# EAGLE design logic_probe-v1.0c (EAGLE 4.16)
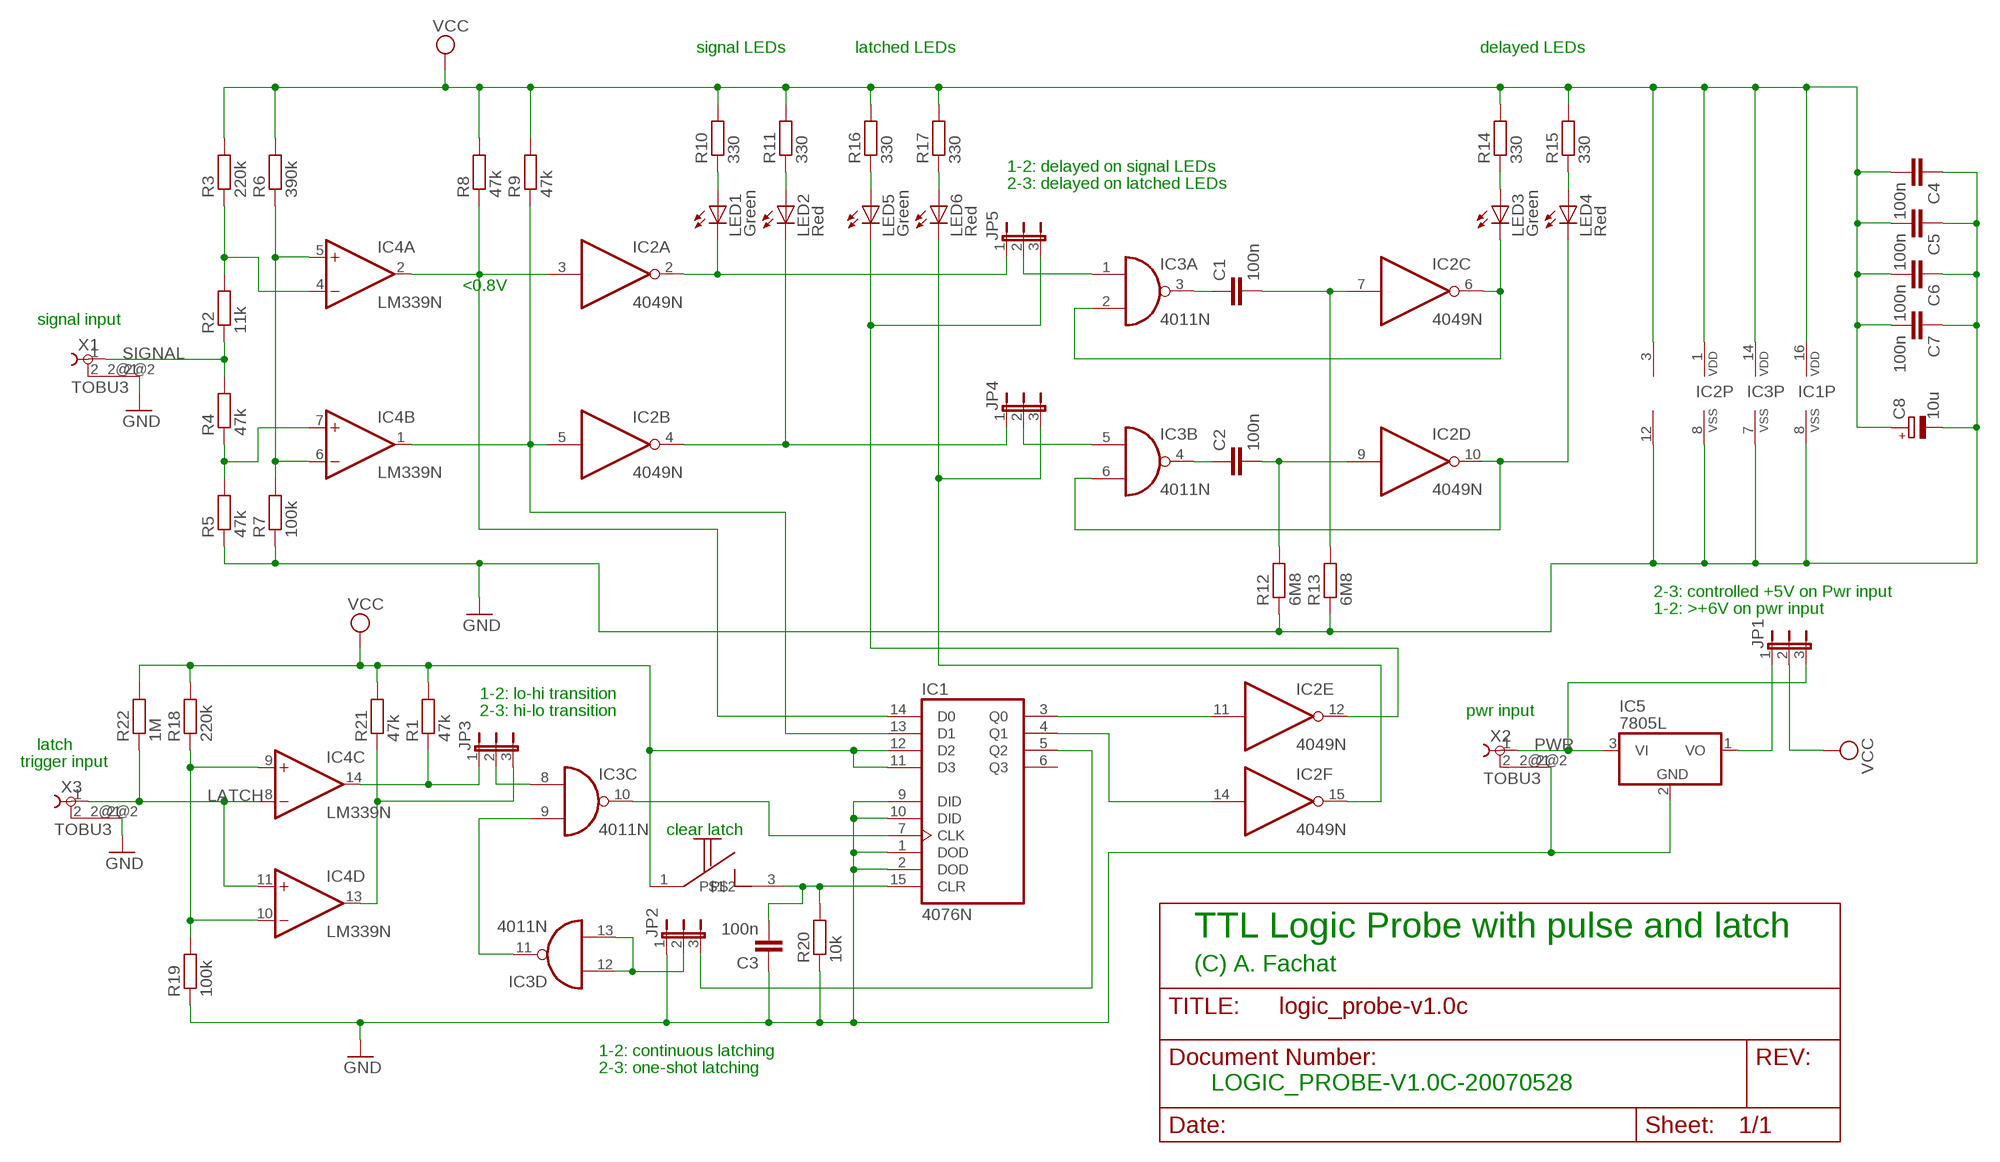
[diagram p0: schematic, sheet 1]

## Parts
C1  100n  C-EU050-025X075  [C050-025X075]
C2  100n  C-EU050-025X075  [C050-025X075]
C3  100n  C-EU050-025X075  [C050-025X075]
C4  100n  C-EU050-025X075  [C050-025X075]
C5  100n  C-EU050-025X075  [C050-025X075]
C6  100n  C-EU050-025X075  [C050-025X075]
C7  100n  C-EU050-025X075  [C050-025X075]
C8  10u  CPOL-EUE2-5  [E2-5]
IC1  4076N  [DIL16]
IC2  4049N  [DIL16]
IC3  4011N  [DIL14]
IC4  LM339N  [DIL14]
IC5  7805L  [TO92]
JP1  JP2E  [JP2]
JP2  JP2E  [JP2]
JP3  JP2E  [JP2]
JP4  JP2E  [JP2]
JP5  JP2E  [JP2]
LED1  Green  LED3MM  [LED3MM]
LED2  Red  LED3MM  [LED3MM]
LED3  Green  LED3MM  [LED3MM]
LED4  Red  LED3MM  [LED3MM]
LED5  Green  LED3MM  [LED3MM]
LED6  Red  LED3MM  [LED3MM]
R1  47k  R-EU_0207/7  [0207/7]
R2  11k  R-EU_0207/7  [0207/7]
R3  220k  R-EU_0207/7  [0207/7]
R4  47k  R-EU_0207/7  [0207/7]
R5  47k  R-EU_0207/7  [0207/7]
R6  390k  R-EU_0207/7  [0207/7]
R7  100k  R-EU_0207/7  [0207/7]
R8  47k  R-EU_0207/7  [0207/7]
R9  47k  R-EU_0207/7  [0207/7]
R10  330  R-EU_0207/7  [0207/7]
R11  330  R-EU_0207/7  [0207/7]
R12  6M8  R-EU_0207/7  [0207/7]
R13  6M8  R-EU_0207/7  [0207/7]
R14  330  R-EU_0207/7  [0207/7]
R15  330  R-EU_0207/7  [0207/7]
R16  330  R-EU_0207/7  [0207/7]
R17  330  R-EU_0207/7  [0207/7]
R18  220k  R-EU_0207/7  [0207/7]
R19  100k  R-EU_0207/7  [0207/7]
R20  10k  R-EU_0207/7  [0207/7]
R21  47k  R-EU_0207/7  [0207/7]
R22  1M  R-EU_0207/7  [0207/7]
U$3  TASTER  [TASTER]
X1  TOBU3  [TOBU3]
X2  TOBU3  [TOBU3]
X3  TOBU3  [TOBU3]

## Nets
GND: C3.1 C4.1 C5.1 C6.1 C7.1 C8.- IC1.1(DOD) IC1.2(DOD) IC1.8(VSS) IC1.9(DID) IC1.10(DID) IC2.8(P:VSS) IC3.7(P:VSS) IC4.12(P:GND) IC5.2(GND) JP2.1 R5.1 R7.1 R12.1 R13.1 R19.1 R20.1 X1.2@2 X2.2@2 X3.2@2
LATCH: IC4.8(C:-IN) IC4.11(D:+IN) R22.1 X3.1
N$1: C1.2 IC2.7(C:I) R13.2
N$2: IC4.4(A:-IN) R2.2 R3.1
N$3: IC1.14(D0) IC2.3(A:I) IC4.2(A:OUT) R8.1
N$4: IC4.7(B:+IN) R4.1 R5.2
N$5: IC4.5(A:+IN) IC4.6(B:-IN) R6.1 R7.2
N$6: C2.2 IC2.9(D:I) R12.2
N$9: IC2.2(A:O) JP5.1 LED1.K(C)
N$10: IC2.4(B:O) JP4.1 LED2.K(C)
N$11: LED1.A R10.1
N$12: LED2.A R11.1
N$13: C1.1 IC3.3(A:O)
N$14: C2.1 IC3.4(B:O)
N$15: IC2.6(C:O) IC3.2(A:I1) LED3.K(C)
N$16: IC2.10(D:O) IC3.6(B:I1) LED4.K(C)
N$17: LED3.A R14.1
N$18: LED4.A R15.1
N$19: IC4.13(D:OUT) JP3.3 R21.1
N$20: LED5.A R16.1
N$21: LED6.A R17.1
N$22: IC1.4(Q1) IC2.14(F:I)
N$23: IC2.15(F:O) JP4.3 LED6.K(C)
N$24: IC2.12(E:O) JP5.3 LED5.K(C)
N$25: IC1.3(Q0) IC2.11(E:I)
N$26: IC4.9(C:+IN) IC4.10(D:-IN) R18.1 R19.2
N$27: IC1.13(D1) IC2.5(B:I) IC4.1(B:OUT) R9.1
N$28: IC4.14(C:OUT) JP3.1 R1.1
N$29: IC1.7(CLK) IC3.10(C:O)
N$30: IC3.1(A:I0) JP5.2
N$31: C3.2 IC1.15(CLR) R20.2 U$3.3
N$32: IC1.5(Q2) JP2.3
N$33: IC3.12(D:I0) IC3.13(D:I1) JP2.2
N$34: IC3.9(C:I1) IC3.11(D:O)
N$36: IC5.1(VO) JP1.1
N$37: IC3.8(C:I0) JP3.2
N$38: IC3.5(B:I0) JP4.2
PWR: IC5.3(VI) JP1.3 X2.1
SIGNAL: R2.1 R4.2 X1.1
VCC: C4.2 C5.2 C6.2 C7.2 C8.+ IC1.11(D3) IC1.12(D2) IC1.16(VDD) IC2.1(P:VDD) IC3.14(P:VDD) IC4.3(P:V+) JP1.2 R1.2 R3.2 R6.2 R8.2 R9.2 R10.2 R11.2 R14.2 R15.2 R16.2 R17.2 R18.2 R21.2 R22.2 U$3.1
Unconnected: IC1.6(Q3) X1.2 X1.2@1 X2.2 X2.2@1 X3.2 X3.2@1

## Notes on the sheet
- signal LEDs | latched LEDs | delayed LEDs
- 1-2: delayed on signal LEDs
- 2-3: delayed on latched LEDs
- <0.8V
- signal input
- 2-3: controlled +5V on Pwr input
- 1-2: >+6V on pwr input
- 1-2: lo-hi transition
- 2-3: hi-lo transition | pwr input
- latch
- trigger input
- clear latch
- TTL Logic Probe with pulse and latch
- (C) A. Fachat
- 1-2: continuous latching
- 2-3: one-shot latching
- LOGIC_PROBE-V1.0C-20070528

## Library data of the parts
C1-C7 = rcl:C-EU: CAPACITOR, European symbol
C8 = rcl:CPOL-EU: POLARIZED CAPACITOR, European symbol
IC1 = 40xx:4076: Quad D-type REGISTER
IC2 = 40xx:4049: Hex inverting BUFFER
IC3 = 40xx:4011: Quad 2-input NAND
IC4 = linear:LM339: Low Power Low Offset Voltage Quad Comparators with open collector; LM139/LM239/LM339/LM2901/LM3302
IC5 = linear:78*: Positive VOLTAGE REGULATOR Source: http://cache.national.com/ds/LM/LM78L05.pdf http://www.fairchildsemi.com/ds/LM/LM7805.pdf
JP1-JP5 = jumper:JP2E: JUMPER
LED1-LED6 = led:LED: LED OSRAM: - CHIPLED LG R971, LG N971, LY N971, LG Q971, LY Q971, LO R971, LY R971 LH N974, LH R974 LS Q976, LO Q976, LY Q976 LO Q996 - Hyper CHIPLED LW Q18S LB Q993, LB Q99A, LB R99A - SideLED LS A670, LO A670, LY A670, LG A670, LP A670 LB A673, LV A673, LT A673, LW A673 LH A674 LY A675 LS A676, LA A676, LO A676, LY A676, LW A676 LS A679, LY A679, LG A679 - Hyper Micro SIDELED® LS Y876, LA Y876, LO Y876, LY Y876 LT Y87S - SmartLED LW L88C, LW L88S LB L89C, LB L89S, LG L890 LS L89K, LO L89K, LY L89K LS L896, LA L896, LO L896, LY L896 - TOPLED LS T670, LO T670, LY T670, LG T670, LP T670 LSG T670, LSP T670, LSY T670, LOP T670, LYG T670 LG T671, LOG T671, LSG T671 LB T673, LV T673, LT T673, LW T673 LH T674 LS T676, LA T676, LO T676, LY T676, LB T676, LH T676, LSB T676, LW T676 LB T67C, LV T67C, LT T67C, LS T67K, LO T67K, LY T67K, LW E67C LS E67B, LA E67B, LO E67B, LY E67B, LB E67C, LV E67C, LT E67C LW T67C LS T679, LY T679, LG T679 LS T770, LO T770, LY T770, LG T770, LP T770 LB T773, LV T773, LT T773, LW T773 LH T774 LS E675, LA E675, LY E675, LS T675 LS T776, LA T776, LO T776, LY T776, LB T776 LHGB T686 LT T68C, LB T68C - Hyper Mini TOPLED® LB M676 - Mini TOPLED Santana® LG M470 LS M47K, LO M47K, LY M47K Source: http://www.osram.convergy.de/
R1-R22 = rcl:R-EU_: RESISTOR, European symbol
U$3 = csa:TASTER
X1-X3 = con-hirschmann:TOBU3: Female Cinch CONNECTOR

## Board
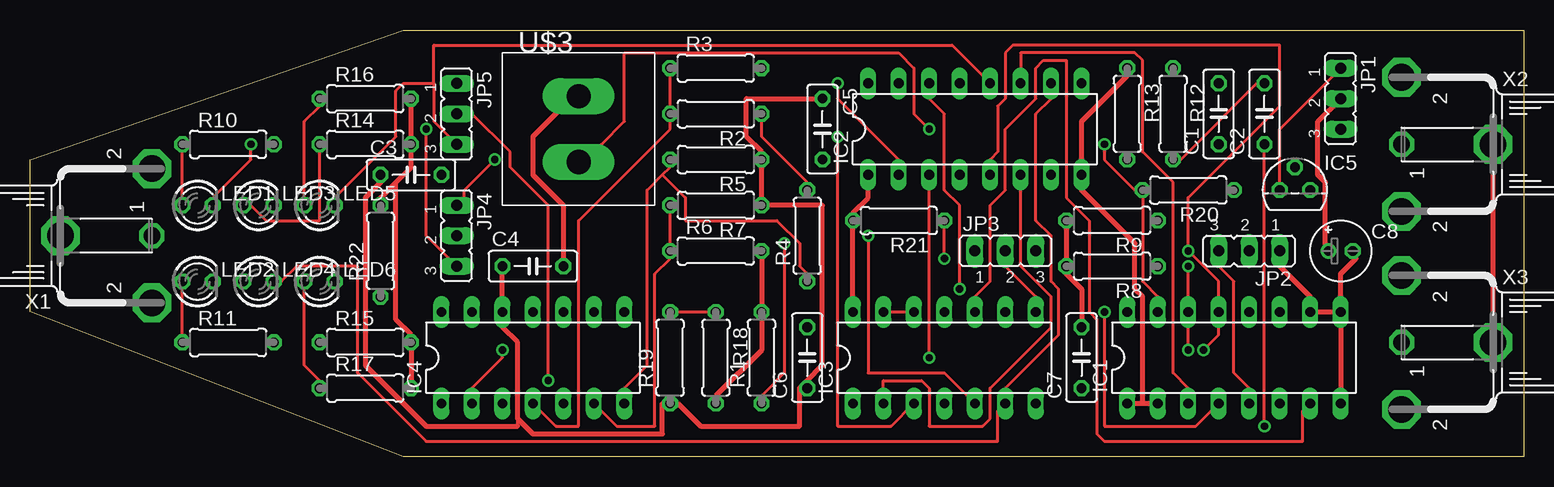
[diagram p1: board, top side]
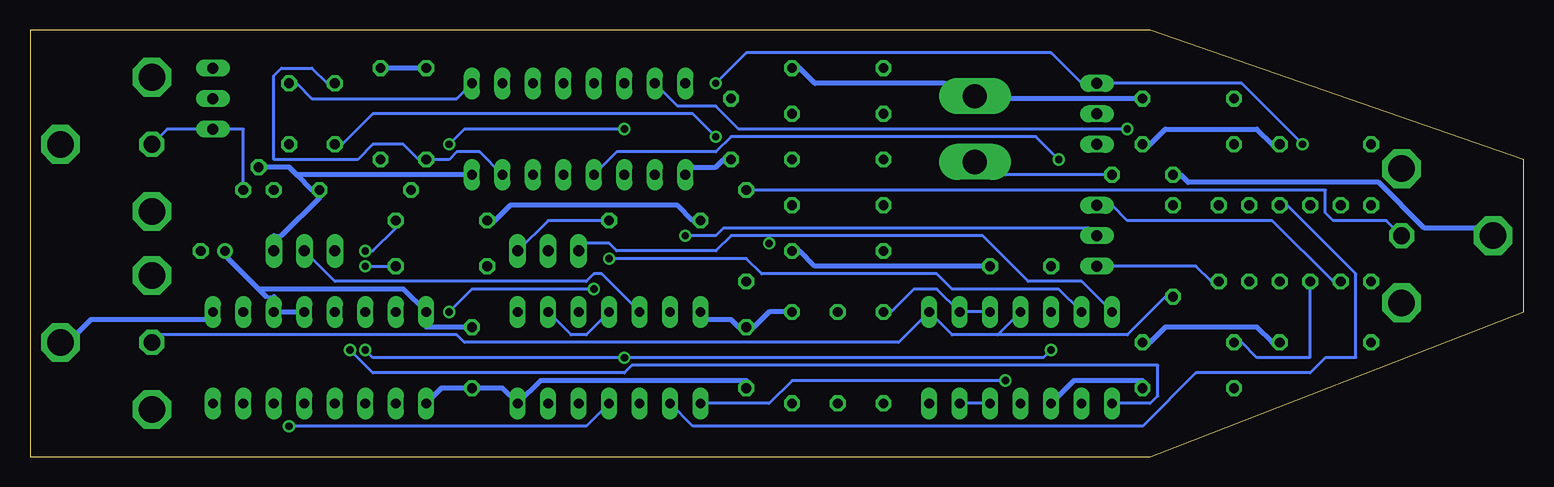
[diagram p2: board, bottom side, seen from below]

Size 124.46 x 35.56 mm. Coordinates in mm from the lower left corner, seen from the top.
Outline: 0,24.77 31.11,35.56 124.46,35.56 124.46,0 31.11,0 0,12.06 0,24.77
Copper layers (1*16): Top 0.035mm / dielectric 1.5mm / Bottom 0.035mm
Design rules "default": minimum track width 10mil, minimum drill 24mil, track to track 8mil, track to pad 8mil, pad to pad 8mil, via to via 8mil, smd to smd 8mil, copper to edge 40mil, drill to drill 8mil, minimum pad ring 10mil, minimum via ring 8mil, stop-mask expansion 4mil, vias tented up to drill 0mil, thermal gap 10mil

### Footprints (pad centres in the part's own frame; a part is rotated, then mirrored left to right if it is on the bottom)
C050-025X075 = drill 0.813 octagon: 1 -2.54,0; 2 2.54,0
E2-5 = drill 0.813 pad 1.27 round: + -1.016,0 | drill 0.813 pad 1.27 octagon: - 1.016,0
DIL16 = drill 0.813 long: 1 -8.89,-3.81; 2 -6.35,-3.81; 3 -3.81,-3.81; 4 -1.27,-3.81; 5 1.27,-3.81; 6 3.81,-3.81; 7 6.35,-3.81; 8 8.89,-3.81; 9 8.89,3.81; 10 6.35,3.81; 11 3.81,3.81; 12 1.27,3.81; 13 -1.27,3.81; 14 -3.81,3.81; 15 -6.35,3.81; 16 -8.89,3.81
DIL14 = drill 0.813 long: 1 -7.62,-3.81; 2 -5.08,-3.81; 3 -2.54,-3.81; 4 0,-3.81; 5 2.54,-3.81; 6 5.08,-3.81; 7 7.62,-3.81; 8 7.62,3.81; 9 5.08,3.81; 10 2.54,3.81; 11 0,3.81; 12 -2.54,3.81; 13 -5.08,3.81; 14 -7.62,3.81
TO92 = drill 0.813 octagon: 1 -1.27,0; 2 0,1.905; 3 1.27,0
JP2 = drill 0.914 long: 1 -2.54,0; 2 0,0; 3 2.54,0
LED3MM = drill 0.813 octagon: A -1.27,0; K 1.27,0
0207/7 = drill 0.813 octagon: 1 -3.81,0; 2 3.81,0
TASTER = drill 2.007 long: 1 0,4.013; 3 0,-1.473
TOBU3 = drill 1.397 octagon: 1 0,-2.54 | drill 2.21 octagon: 2 5.588,-2.54; 2@1 -5.588,-2.54; 2@2 0,5.08

### Placement (x,y rotation side)
C1  99.06,28.58 90 top
C2  102.87,28.58 90 top
C3  31.75,23.5 0 top
C4  41.91,15.87 0 top
C5  66.04,27.3 270 top
C6  64.77,8.26 90 top
C7  87.63,8.26 90 top
C8  109.22,17.15 0 top
IC1  100.33,8.26 0 top
IC2  78.74,27.3 0 top
IC3  76.2,8.26 0 top
IC4  41.91,8.26 0 top
IC5  105.41,22.23 0 top
JP1  109.22,29.84 270 top
JP2  101.6,17.15 180 top
JP3  81.28,17.15 0 top
JP4  35.56,18.41 270 top
JP5  35.56,28.58 270 top
LED1  13.97,20.95 0 top
LED2  13.97,14.6 0 top
LED3  19.05,20.95 0 top
LED4  19.05,14.6 0 top
LED5  24.13,20.95 0 top
LED6  24.13,14.6 0 top
R1  60.96,8.26 90 top
R2  57.15,28.58 180 top
R3  57.15,32.38 0 top
R4  64.77,18.41 90 top
R5  57.15,24.77 180 top
R6  57.15,17.15 0 top
R7  57.15,20.95 180 top
R8  90.17,15.87 180 top
R9  90.17,19.69 180 top
R10  16.51,26.04 0 top
R11  16.51,9.53 0 top
R12  95.25,28.58 270 top
R13  91.44,28.58 270 top
R14  27.94,26.04 0 top
R15  27.94,9.53 0 top
R16  27.94,29.84 0 top
R17  27.94,5.71 0 top
R18  57.15,8.26 270 top
R19  53.34,8.26 90 top
R20  96.52,22.23 180 top
R21  72.39,19.69 180 top
R22  29.21,17.15 90 top
U$3  45.72,26.04 0 top
X1  7.62,18.41 90 top
X2  116.84,26.04 270 top
X3  116.84,9.53 270 top

### Tracks (layer width: path | path; a pad name or v marks a point on that pad's centre or on a via)
GND
  Top 0.254: 40.64,2.54 40.64,3.17
  Top 0.406: R13.1 91.44,31.75 87.63,27.94 IC2.8 87.63,22.23 92.08,17.78 92.08,13.97 92.71,13.33 92.71,4.45 | IC1.9 IC1.10 106.68,13.33 104.14,15.87 JP2.1 | IC1.9 IC1.8 | C8.- 110.49,16.51 109.22,15.24 IC1.9 | X3.2@2 X2.2@2 | C5.1 59.69,29.84 59.69,26.67 60.96,25.4 R5.1 R7.1 66.04,20.95 66.04,7.62 64.77,6.35 C6.1 64.14,5.71 64.14,2.54 55.88,2.54 53.98,4.45 R19.1 52.7,4.45 52.7,1.9 41.91,1.9 40.64,3.17 40.64,9.53 39.37,10.79 IC4.12 C4.1 | IC1.1 92.71,4.45 | 92.71,4.45 IC1.2 | 40.64,2.54 33.02,2.54 27.94,7.62 27.94,21.59 29.21,22.86 C3.1
  Bottom 0.254: IC1.9 109.86,11.43 | 103.5,18.41 104.14,18.41 | R20.1 100.33,21.59 | 28.57,23.5 C3.1 | C6.1 64.77,6.35
  Bottom 0.406: R13.1 R12.1 | 102.23,23.5 102.87,24.13 IC5.2 | 102.23,23.5 100.97,22.23 R20.1 | IC2.8 102.23,23.5 | 109.86,11.43 119.38,11.43 120.65,10.16 X3.2@2 | 100.33,21.59 103.5,18.41 | 104.14,18.41 JP2.1 | 28.57,23.5 27.94,22.86 12.06,22.86 8.26,19.05 3.81,19.05 X1.2@2 | IC1.1 90.17,5.71 C7.1 85.09,5.71 IC3.7 81.92,6.35 64.77,6.35
LATCH
  Bottom 0.254: 43.81,10.16 47.62,10.16 IC4.8 52.07,9.53 88.27,9.53 88.9,10.16 113.67,10.16 X3.1 | 43.81,10.16 IC4.11 | 43.81,10.16 33.02,10.16 29.84,13.33 R22.1
N$1
  Bottom 0.254: IC2.7 87,25.4 88.9,25.4 89.53,24.77 R13.2 92.08,24.77 93.34,26.04 95.89,26.04 97.16,24.77 104.14,24.77 104.14,31.75 103.5,32.38 100.97,32.38 99.69,31.12 C1.2
N$2
  Top 0.254: IC4.4 43.81,2.54 45.72,2.54 45.72,19.69 53.34,27.3 R2.2 R3.1
N$3  (via drill 0.61)
  Top 0.254: v96.52,15.87 IC1.14 v96.52,8.89 | v39.37,8.89 39.37,8.26 36.83,5.71 IC4.2 | v74.93,8.26 IC2.3
  Bottom 0.254: v96.52,15.87 R8.1 | v39.37,8.89 40.01,8.26 v74.93,8.26 95.89,8.26 v96.52,8.89
N$4
  Top 0.254: 52.7,23.5 53.34,24.13 R5.2 | 52.7,23.5 51.44,22.23 51.44,7.62 49.53,5.71 IC4.7 | 52.7,23.5 54.61,21.59 54.61,19.69 62.23,19.69 64.14,17.78 64.14,15.87 64.77,15.24 R4.1
N$5
  Top 0.254: R7.2 R6.1 53.34,16.51 52.07,15.24 52.07,2.54 48.9,2.54 IC4.6
  Bottom 0.254: IC4.5 IC4.6
N$6
  Top 0.254: R12.2 95.89,24.77 102.23,31.12 C2.2
  Bottom 0.254: IC2.9 88.9,29.84 100.97,29.84 102.23,31.12 C2.2
N$9  (via drill 0.61)
  Top 0.254: v18.41,26.04 18.41,24.77 15.24,21.59 LED1.K | v67.31,31.12 67.31,29.84 72.39,24.77 IC2.2
  Bottom 0.254: v18.41,26.04 23.5,31.12 JP5.1 36.83,31.12 39.37,33.66 64.77,33.66 v67.31,31.12
N$10  (via drill 0.61)
  Top 0.254: v38.73,24.77 36.2,22.23 36.2,21.59 JP4.1
  Bottom 0.254: LED2.K 15.88,14.6 20.95,19.69 33.02,19.69 34.29,20.95 JP4.1 | v38.73,24.77 40.64,26.67 66.04,26.67 67.31,25.4 75.56,25.4 IC2.4
N$11
  Top 0.254: LED1.A R10.1
N$12
  Top 0.254: R11.1 LED2.A
N$13  (via drill 0.61)
  Top 0.254: v67.31,26.67 67.31,2.54 71.75,2.54 IC3.3
  Bottom 0.254: v67.31,26.67 69.22,28.58 95.89,28.58 98.42,26.04 C1.1
N$14  (via drill 0.61)
  Top 0.254: v102.87,2.54 C2.1
  Bottom 0.254: v102.87,2.54 78.11,2.54 IC3.4
N$15
  Top 0.254: IC2.6 82.55,15.87 85.09,13.33 85.09,10.79 80.01,5.71 80.01,3.17 79.38,2.54 74.93,2.54 74.93,5.71 74.3,6.35 71.12,6.35 IC3.2
  Bottom 0.254: LED3.K 19.68,20.95 13.97,15.24 13.97,8.26 16.51,8.26 17.78,6.99 27.3,6.99 31.75,2.54 69.22,2.54 IC3.2
N$16
  Top 0.254: LED4.K 20.95,14.6 22.23,15.87 27.3,15.87 27.3,6.99 33.02,1.27 80.64,1.27 80.64,3.81 IC3.6 81.28,5.71 85.72,10.16 85.72,13.97 85.09,14.6 85.09,18.41 83.82,19.69 83.82,28.58 85.09,29.84 IC2.10
N$17
  Top 0.254: LED3.A 18.41,20.95 19.68,19.69 24.13,19.69 R14.1
N$18
  Bottom 0.254: LED4.A 17.78,8.26 22.23,8.26 23.5,9.53 R15.1
N$19  (via drill 0.61)
  Top 0.254: v76.2,16.51 R21.1
  Bottom 0.254: v76.2,16.51 64.77,16.51 63.5,15.24 48.9,15.24 47.62,13.97 38.73,13.97 IC4.13 | JP3.3 81.28,19.69 R21.1
N$20
  Top 0.254: LED5.A 22.86,27.94 24.13,29.21 R16.1
N$21
  Top 0.254: R17.1 24.13,6.35 22.86,7.62 LED6.A
N$22  (via drill 0.61)
  Top 0.254: v89.53,12.06 89.53,2.54 97.16,2.54 IC1.4 | v77.47,13.97 77.47,20.95 76.2,22.23 76.2,28.58 74.93,29.84 IC2.14
  Bottom 0.254: v89.53,12.06 87.63,13.97 v77.47,13.97
N$23  (via drill 0.61)
  Top 0.254: v33.02,27.3 33.02,18.41 JP4.3
  Bottom 0.254: LED6.K 26.04,14.6 27.3,15.87 JP4.3 | v33.02,27.3 65.41,27.3 67.31,29.21 70.48,29.21 IC2.15
N$24
  Top 0.254: 33.66,31.12 31.11,31.12 30.48,30.48 30.48,26.67 25.4,21.59 LED5.K | 33.66,31.12 33.66,27.94 JP5.3 | 33.66,31.12 33.66,34.29 76.83,34.29 IC2.12
N$25
  Top 0.254: IC1.3 96.52,5.71 95.25,6.99 95.25,22.86 92.71,25.4 92.71,33.02 92.08,33.66 82.55,33.66 IC2.11
N$26
  Top 0.254: R19.2 R18.1
  Bottom 0.254: IC4.10 IC4.9 48.9,13.97 50.8,13.97 52.7,12.06 R19.2
N$27  (via drill 0.61)
  Top 0.254: v97.79,8.89 99.06,10.16 IC1.13 99.06,14.6 v96.52,17.15 96.52,21.59 104.14,29.21 104.14,34.29 81.92,34.29 81.28,33.66 81.28,29.84 80.64,29.21 80.64,25.4 80.01,24.77 IC2.5
  Bottom 0.254: v97.79,8.89 95.89,6.99 74.93,6.99 74.3,7.62 30.48,7.62 30.48,5.08 31.11,4.45 IC4.1 | v96.52,17.15 95.89,17.15 93.98,19.05 R9.1
N$28  (via drill 0.61)
  Top 0.254: v62.87,17.78 62.87,6.99 60.96,5.08 R1.1
  Bottom 0.254: 62.87,18.41 66.04,18.41 67.31,17.15 75.56,17.15 76.2,17.78 78.11,17.78 JP3.1 | 62.87,18.41 45.09,18.41 41.27,14.6 36.83,14.6 IC4.14 | 62.87,18.41 v62.87,17.78
N$29
  Top 0.254: IC3.10 78.74,13.33 80.01,14.6 80.01,20.95 81.28,22.23 81.28,27.3 83.82,29.84 83.82,32.38 84.45,33.02 86.36,33.02 86.36,21.59 88.27,19.69 88.27,12.06 88.9,11.43 88.9,1.9 89.53,1.27 106.05,1.27 106.05,3.81 IC1.7
N$30  (via drill 0.61)
  Top 0.254: v43.18,6.35 43.18,20.95 40.01,24.13 40.01,25.4 36.83,28.58 JP5.2
  Bottom 0.254: v43.18,6.35 60.96,6.35 62.87,4.45 IC3.1
N$31  (via drill 0.61)
  Top 0.254: IC1.15 93.98,13.33 92.71,14.6 R20.2 92.08,22.23 89.53,24.77 v89.53,26.04 | v74.93,27.3 73.66,28.58 73.66,32.38 72.39,33.66 49.53,33.66 49.53,27.94 47.62,26.04 U$3.3
  Bottom 0.254: C3.2 43.18,23.5 U$3.3 | v89.53,26.04 88.27,27.3 v74.93,27.3
N$32
  Top 0.254: IC1.5 101.6,5.71 100.33,6.99 100.33,14.6 99.06,15.87 JP2.3
N$33
  Top 0.254: IC3.13 IC3.12
  Bottom 0.254: JP2.2 99.06,14.6 78.11,14.6 77.47,15.24 76.83,15.24 IC3.12
N$34
  Bottom 0.254: IC3.11 78.11,10.16 79.38,10.16 IC3.9
N$36
  Top 0.254: IC5.1 104.14,27.3 JP1.1
N$37
  Top 0.254: IC3.8 83.82,13.33 81.28,15.87 JP3.2
N$38  (via drill 0.61)
  Top 0.254: v69.85,18.41 69.85,6.99 76.2,6.99 IC3.5
  Bottom 0.254: v69.85,18.41 67.31,18.41 66.67,19.05 36.2,19.05 JP4.2
PWR
  Bottom 0.254: IC5.3 106.68,27.3 JP1.3 113.03,27.3 X2.1
SIGNAL
  Top 0.254: R4.2 64.77,22.86 60.96,26.67 R2.1
  Bottom 0.254: X1.1 11.43,19.69 15.88,19.69 16.51,20.32 16.51,22.23 R4.2
VCC
  Top 0.406: R17.2 R15.2 31.75,10.16 30.48,11.43 30.48,22.86 | 30.48,22.86 31.75,24.13 R14.2 R16.2 | 30.48,22.86 29.21,21.59 R22.2 | R9.2 R8.2 86.36,15.24 87.63,13.97 C7.2 | JP1.2 107.31,27.94 107.31,23.5 107.95,22.86 107.95,17.78 C8.+ | IC2.1 69.85,21.59 68.58,20.32 R21.2 IC3.14 | R18.2 57.15,5.08 60.96,8.89 R1.2 R6.2 | U$3.1 43.81,28.58 41.91,26.67 41.91,23.5 44.45,20.95 C4.2
  Bottom 0.254: 31.11,9.53 R15.2 | 20.95,26.04 R10.2 | R14.2 31.11,26.04 | 104.78,13.33 104.14,13.33 | 107.95,16.51 C8.+ | 60.33,17.15 R6.2 | IC2.1 69.22,24.13 | C6.2 65.41,10.79 | 85.72,19.69 R9.2
  Bottom 0.406: IC4.3 37.47,6.35 31.75,6.35 R17.2 | 31.11,9.53 29.84,10.79 22.23,10.79 20.95,9.53 R11.2 | 20.95,26.04 22.23,27.3 29.84,27.3 31.11,26.04 | R3.2 60.33,32.38 59.05,31.12 48.26,31.12 U$3.1 43.18,29.84 R16.2 | C7.2 91.44,10.79 IC1.16 93.34,13.97 105.41,13.97 | IC1.12 IC1.11 104.14,13.33 | 105.41,13.97 104.78,13.33 | 105.41,13.97 107.95,16.51 | 60.33,17.15 59.05,15.87 C4.2 | 69.22,24.13 67.31,24.13 66.67,24.77 C5.2 | 65.41,10.79 66.04,11.43 67.94,11.43 IC3.14 | C6.2 64.14,10.79 62.87,12.06 R1.2 | 85.72,19.69 84.45,20.95 70.48,20.95 69.22,19.69 R21.2